# Altium schematic sheet 17_IO_HEADERS.SchDoc
size A3; DocumentNumber: 17; SheetNumber: 17; SheetTotal: 21
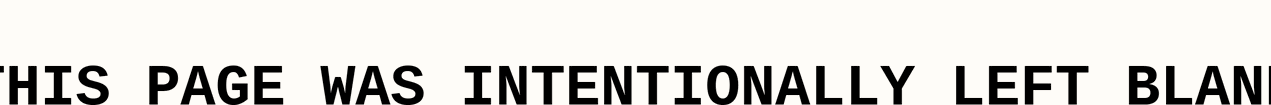
[diagram p0: 17_IO_HEADERS.SchDoc]

## Notes on the sheet
- THIS PAGE WAS INTENTIONALLY LEFT BLANK